# EAGLE schematic powerpartial_proto2 (EAGLE 7.2.0)
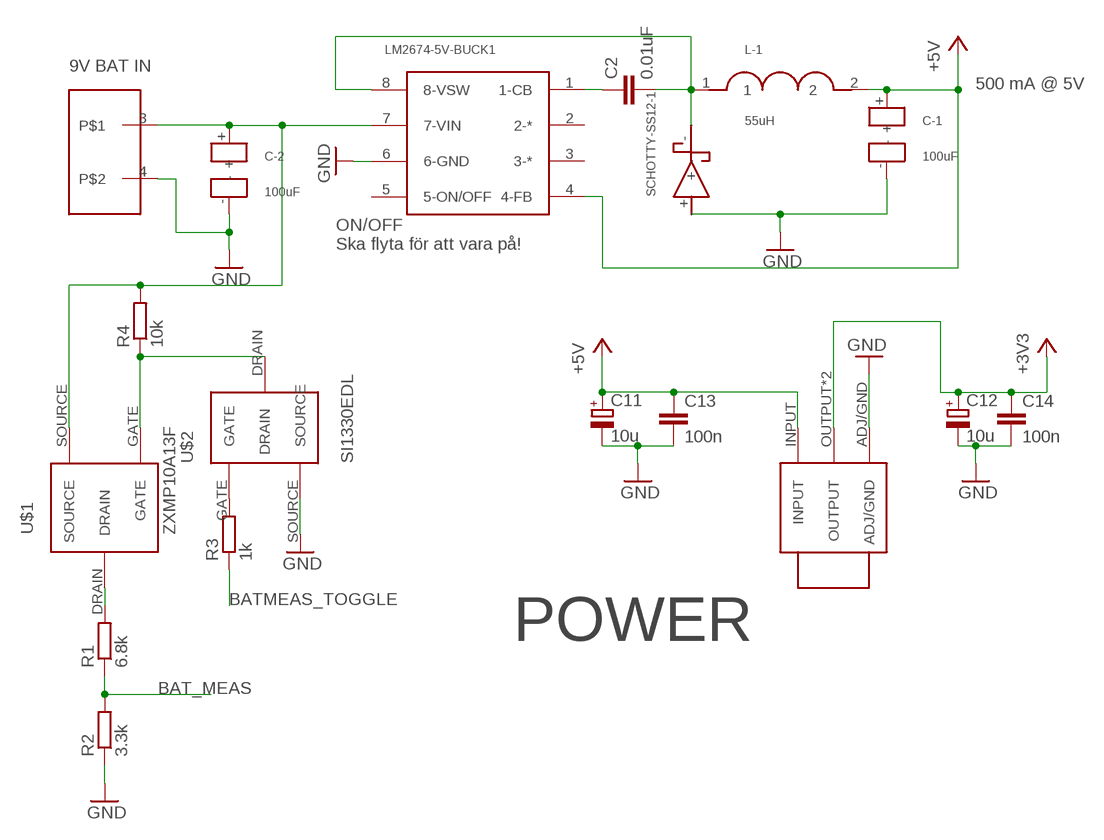
[diagram p0: schematic, sheet 1]

## Parts
C2  0.01uF  C-EUC0805  [C0805]
C11  10u  CPOL-EU153CLV-0505  [153CLV-0505]
C12  10u  CPOL-EU153CLV-0505  [153CLV-0505]
C13  100n  C-EUC0805  [C0805]
C14  100n  C-EUC0805  [C0805]
C-1  100uF  PANASONIC-CAP  [CAP-6.3MM-DIA]
C-2  100uF  PANASONIC-CAP  [CAP-6.3MM-DIA]
L-1  55uH  55UH-INDUKTOR  [INDUCTOR]
LM1117-1  LM1117  [LM1117]
LM2674-5V-BUCK1  LM2674-5VBUCK  [LM2674]
R1  6.8k  R-EU_R0805  [R0805]
R2  3.3k  R-EU_R0805  [R0805]
R3  1k  R-EU_R0805  [R0805]
R4  10k  R-EU_R0805  [R0805]
SCHOTTY-SS12-1  SCHOTTY-SS12  [SCHOTTY]
SKRUVPLINT_2P1  SKRUVPLINT_2P  [SKRUVPLINT_2P]
U$1  ZXMP10A13F  [P-CHANNEL]
U$2  SI1330EDL  [SOT-323]

## Nets
+3V3: C12.+ C14.1 LM1117-1.OUTPUT LM1117-1.OUTPUT2(OUTPUT)
+5V: C11.+ C13.1 C-1.+ L-1.2 LM1117-1.INPUT LM2674-5V-BUCK1.4(4-FB)
BAT_MEAS: R1.1 R2.2
BATMEAS_TOGGLE: R3.1
BATSUP: C-2.+ LM2674-5V-BUCK1.7(7-VIN) R4.2 SKRUVPLINT_2P1.3 U$1.SOURCE
GND: C11.- C12.- C13.2 C14.2 C-1.- C-2.- LM1117-1.ADJ/GND LM2674-5V-BUCK1.6(6-GND) R2.1 SCHOTTY-SS12-1.+ SKRUVPLINT_2P1.4 U$2.SOURCE
N$1: R1.2 U$1.DRAIN
N$2: C2.1 LM2674-5V-BUCK1.1(1-CB)
N$4: R3.2 U$2.GATE
N$7: R4.1 U$1.GATE U$2.DRAIN
VOUT: C2.2 L-1.1 LM2674-5V-BUCK1.8(8-VSW) SCHOTTY-SS12-1.-
Unconnected: LM2674-5V-BUCK1.2(2-*) LM2674-5V-BUCK1.3(3-*) LM2674-5V-BUCK1.5(5-ON/OFF)

## Notes on the sheet
- 9V BAT IN
- 500 mA @ 5V
- ON/OFF
  Ska flyta för att vara på!
- POWER

## Library data of the parts
C2 C13 C14 = rcl:C-EU: CAPACITOR, European symbol
C11 C12 = rcl:CPOL-EU: POLARIZED CAPACITOR, European symbol
C-1 C-2 = panasonic-cap-100u:PANASONIC-CAP
L-1 = inductor-55u:55UH-INDUKTOR
LM1117-1 = LM1117-3v3_vreg:LM1117
LM2674-5V-BUCK1 = LM2674-5v-buck:LM2674-5VBUCK
R1-R4 = rcl:R-EU_: RESISTOR, European symbol
SCHOTTY-SS12-1 = schotty-SS12:SCHOTTY-SS12
SKRUVPLINT_2P1 = skruvplint2p_CTB0700:SKRUVPLINT_2P
U$1 = ZXMP10A13F:ZXMP10A13F
U$2 = SI1330EDL:SI1330EDL